# EAGLE design schematic (EAGLE 7.5.0)
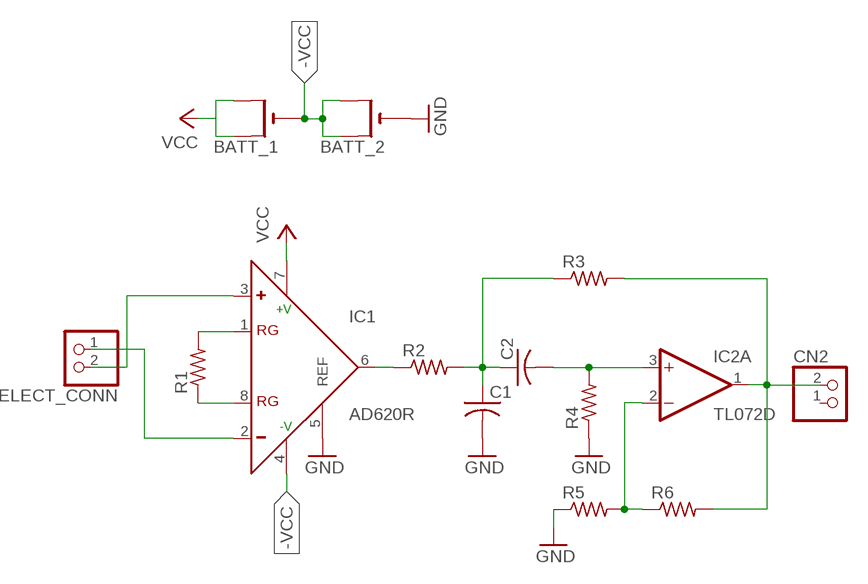
[diagram p0: schematic, sheet 1]

## Parts
BATT_1  CR1220SMT  [CR1220-SMD]
BATT_2  CR1220SMT  [CR1220-SMD]
C1  C-USC0805  [C0805]
C2  C-USC0805  [C0805]
CN2  JST_2PIN-SMT-RA  [JST-PH-2-SMT-RA]
ELECT_CONN  JST_2PIN-SMT-RA  [JST-PH-2-SMT-RA]
IC1  AD620R  [SO8]
IC2  TL072D  [SO08]
R1  R-US_R0805  [R0805]
R2  R-US_R0805  [R0805]
R3  R-US_R0805  [R0805]
R4  R-US_R0805  [R0805]
R5  R-US_R0805  [R0805]
R6  R-US_R0805  [R0805]

## Nets
-VCC: BATT_1.- BATT_2.+$1(+) BATT_2.+$2(+1) IC1.4(-V)
GND: BATT_2.- C1.2 IC1.5(REF) R4.1 R5.1
N$1: IC1.1(RG) R1.2
N$2: IC1.8(RG) R1.1
N$3: IC1.6(OUT) R2.1
N$4: C1.1 C2.1 R2.2 R3.1
N$5: C2.2 IC2.3(A:+IN) R4.2
N$6: CN2.2 IC2.1(A:OUT) R3.2 R6.2
N$7: IC2.2(A:-IN) R5.2 R6.1
N$8: ELECT_CONN.2 IC1.3(+)
N$9: ELECT_CONN.1 IC1.2(-)
VCC: BATT_1.+$1(+) BATT_1.+$2(+1) IC1.7(+V)
Unconnected: CN2.1 IC2.5(B:+IN) IC2.6(B:-IN) IC2.7(B:OUT)

## Power pins joined to a net without a drawn wire
V+: IC2.8(P:V+)
V-: IC2.4(P:V-)

## Library data of the parts
BATT_1 BATT_2 = adafruit:CR1220: CR1216/CR1220/CR1225 12mm 3V lithium coin cell Great for battery packup. Both SMT and THM holders. Note the THM package has the ground pads on both sides of the PCB so that the masks are the same - this reduces the cost
C1 C2 = adafruit:C-US: CAPACITOR, American symbol
CN2 ELECT_CONN = adafruit:JST_2PIN: JST 2-Pin Connectors of various flavors SMT-RA (S2B-PH-SM4) 4UConnector #17311 SMT (B2B-PH-SM4) THM-RA (S2B-PH) THM (B2B-PH)
IC1 = analog-devices:AD620: Low Cost, Low Power, Instrumentation Amplifier Source: http://www.analog.com/UploadedFiles/Data_Sheets/37793330023930AD620_e.pdf; MPN: AD620AR; OC_FARNELL: 1464424; OC_NEWARK: 05F7109
IC2 = linear:TL072: OP AMP
R1-R6 = resistor:R-US_: RESISTOR, American symbol

## Net classes
0 default: width 0.305 mm, drill 0.61 mm, clearance 0.254 mm

## Board
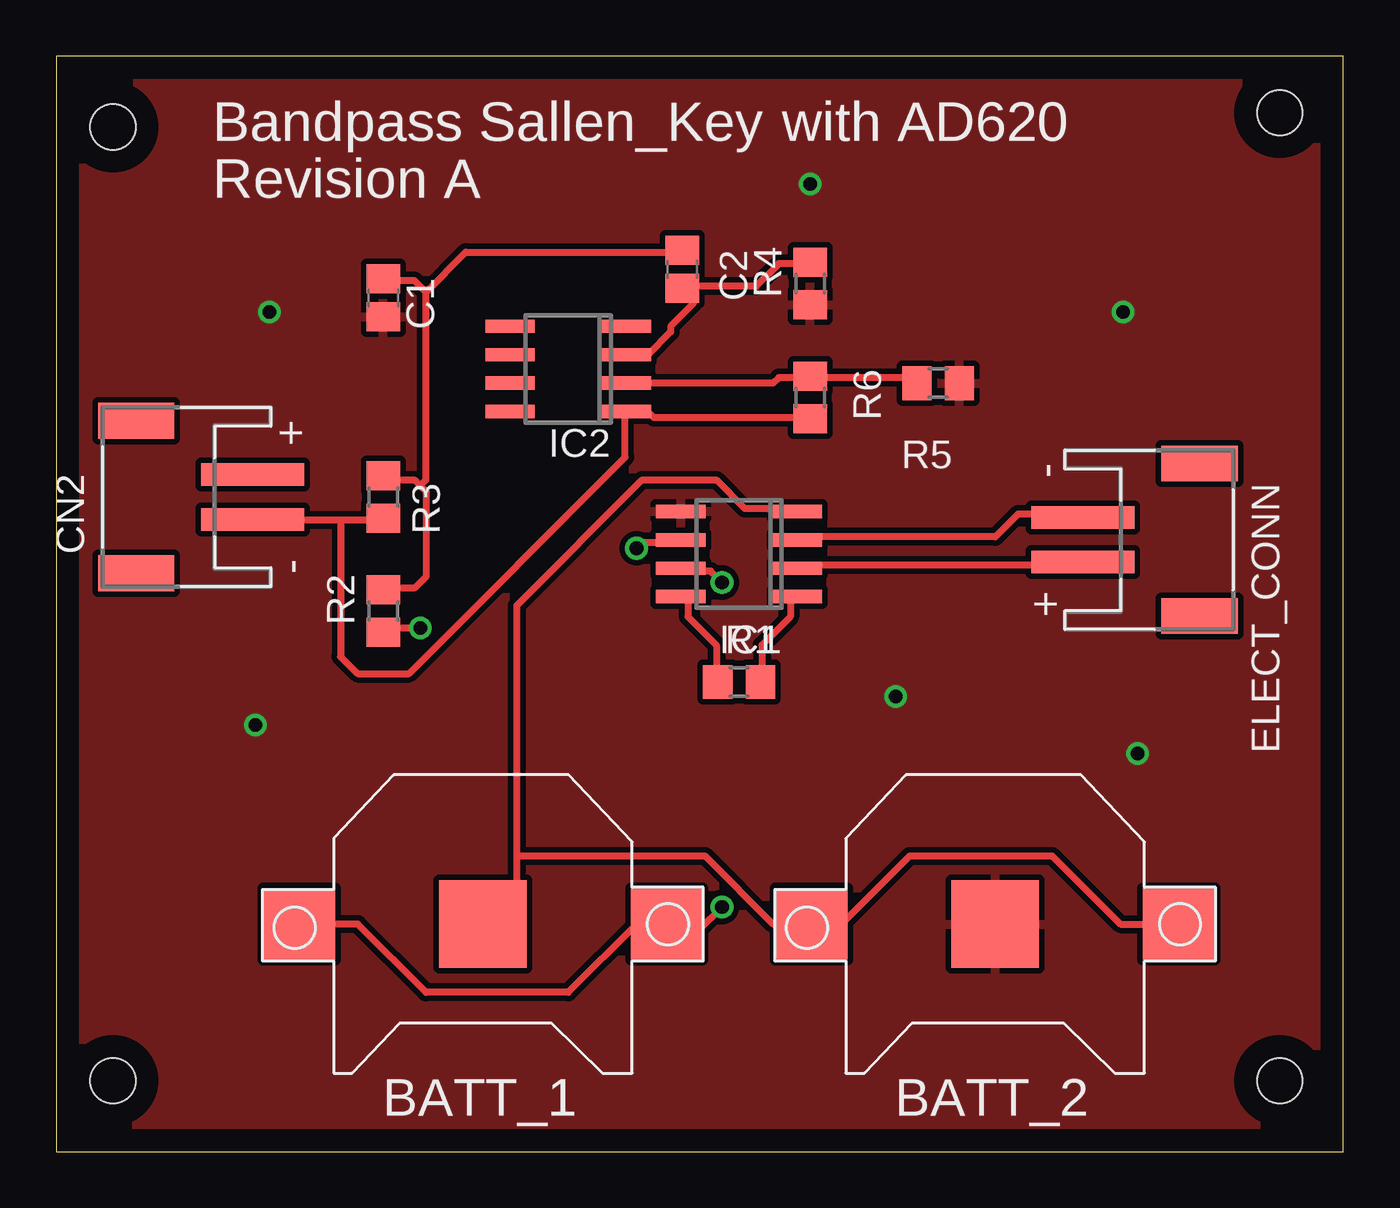
[diagram p1: board, top side]
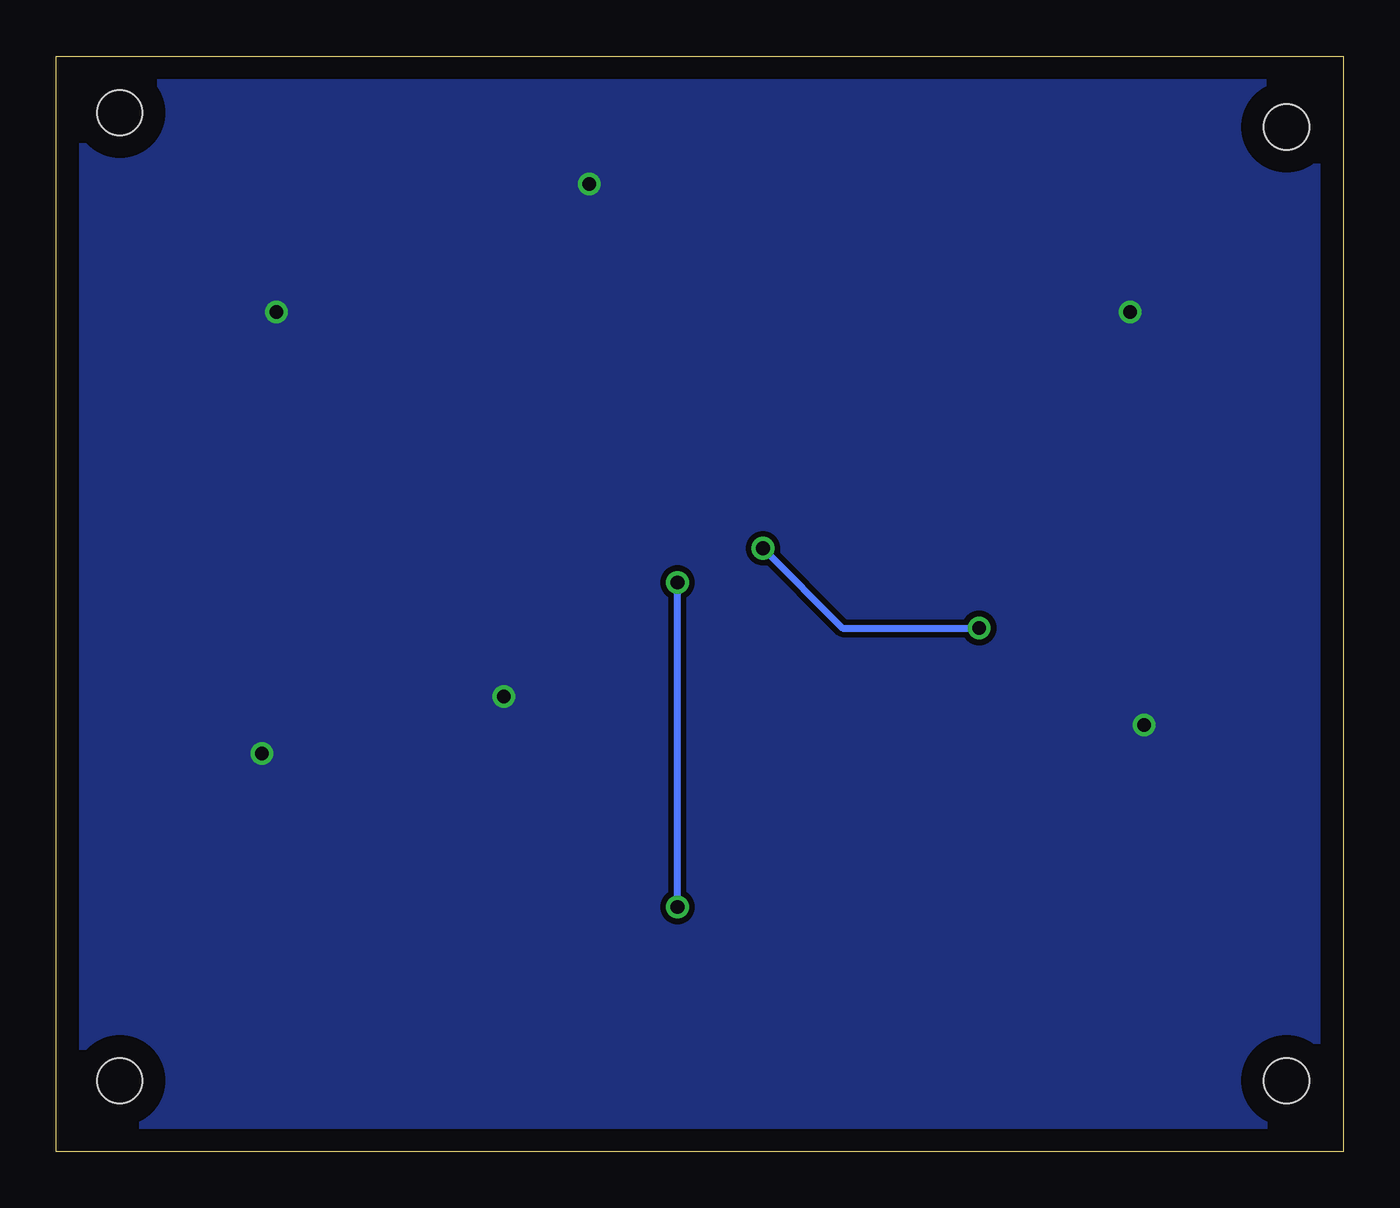
[diagram p2: board, bottom side, seen from below]

Size 57.45 x 48.88 mm. Coordinates in mm from the lower left corner, seen from the top.
Outline: 0,0 57.45,0 57.45,48.88 0,48.88 0,0
Copper layers (1*16): Top 0.035mm / dielectric 1.5mm / Bottom 0.035mm
Design rules "default *": minimum track width 10mil, minimum drill 20mil, track to track 8mil, track to pad 8mil, pad to pad 8mil, via to via 8mil, smd to smd 8mil, copper to edge 40mil, drill to drill 8mil, minimum pad ring 10mil, minimum via ring 8mil, stop-mask expansion 4mil, vias tented up to drill 0mil, thermal gap 10mil
Holes 2 mm at 2.54,45.72 2.54,3.17 54.61,3.17 54.61,46.35

### Footprints (pad centres in the part's own frame; a part is rotated, then mirrored left to right if it is on the bottom)
CR1220-SMD = smd 3.2 x 3.2: +$1 -8.2,0; +$2 8.2,0 | smd 3.9 x 3.9: - 0,0
C0805 = smd 1.3 x 1.5: 1 -0.85,0; 2 0.85,0
JST-PH-2-SMT-RA = smd 1 x 4.6: 1 1,-3.7; 2 -1,-3.7 | smd 1.6 x 3.4: NC1 -3.4,1.5; NC2 3.4,1.5
SO8 = smd 0.6 x 2.2: 1 -1.905,-2.6; 2 -0.635,-2.6; 3 0.635,-2.6; 4 1.905,-2.6; 5 1.905,2.6; 6 0.635,2.6; 7 -0.635,2.6; 8 -1.905,2.6
SO08 = smd 0.6 x 2.2: 1 -1.905,-2.6; 2 -0.635,-2.6; 3 0.635,-2.6; 4 1.905,-2.6; 5 1.905,2.6; 6 0.635,2.6; 7 -0.635,2.6; 8 -1.905,2.6
R0805 = smd 1.3 x 1.5: 1 -0.95,0; 2 0.95,0

### Placement (x,y rotation side)
BATT_1  19.05,10.16 180 top
BATT_2  41.91,10.16 180 top
C1  14.61,38.1 270 top
C2  27.94,39.37 270 top
CN2  5.08,29.21 90 top
ELECT_CONN  49.53,27.3 270 top
IC1  30.48,26.67 90 top
IC2  22.86,34.92 90 top
R1  30.48,20.95 0 top
R2  14.61,24.13 90 top
R3  14.61,29.21 270 top
R4  33.66,38.73 90 top
R5  39.37,34.29 180 top
R6  33.66,33.66 270 top

### Tracks (layer width: path | path; a pad name or v marks a point on that pad's centre or on a via)
-VCC
  Top 0.305: 20.57,13.21 20.57,11.68 BATT_1.- | 20.57,13.21 20.57,24.38 26.16,29.97 29.46,29.97 30.73,28.7 33.02,28.7 IC1.4 | 20.57,13.21 28.96,13.21 32,10.16 BATT_2.+$2 35.05,10.16 38.1,13.21 44.45,13.21 47.5,10.16 BATT_2.+$1
GND  (via drill 0.6)
  other vias: 9.53,37.47 8.89,19.05 47.62,37.47 37.47,20.32 48.26,17.78 33.66,43.18
  pour Top: -0.64,65.41 -0.64,-0.64 58.42,-0.64 58.42,65.41
  pour Bottom: -0.64,49.53 -0.64,-0.64 58.42,-0.64 58.42,49.53
N$1
  Top 0.305: R1.2 31.5,21.08 31.5,22.61 32.77,23.88 32.77,24.64 33.02,24.89 IC1.1
N$2
  Top 0.305: R1.1 29.46,21.08 29.46,22.61 28.19,23.88 28.19,24.64 27.94,24.89 IC1.8
N$3  (via drill 0.61)
  Top 0.305: v16.26,23.37 14.73,23.37 R2.1 | v25.91,26.92 26.16,27.18 27.69,27.18 IC1.6
  Bottom 0.305: v16.26,23.37 22.35,23.37 v25.91,26.92
N$4
  Top 0.305: 16.26,29.72 16,29.97 14.73,29.97 R3.1 | 16.26,29.72 16.51,29.46 16.51,25.65 16,25.15 14.73,25.15 R2.2 | 16.51,38.35 16,38.86 14.73,38.86 C1.1 | 16.51,38.35 16.51,29.97 16.26,29.72 | 16.51,38.35 18.29,40.13 27.94,40.13 C2.1
N$5
  Top 0.305: 28.45,38.61 31.24,38.61 32.26,39.62 33.53,39.62 R4.2 | 28.45,38.61 27.94,38.61 C2.2 28.45,38.61 | IC2.3 26.42,35.56 27.43,36.58 27.43,36.83 28.45,37.85 28.45,38.61
N$6
  Top 0.305: R6.2 33.53,32.77 26.67,32.77 26.42,33.02 IC2.1 25.4,33.02 25.4,30.99 15.75,21.34 13.46,21.34 12.7,22.1 12.7,28.19 | 12.7,28.19 8.89,28.19 CN2.2 | 12.7,28.19 14.48,28.19 R3.2
N$7
  Top 0.305: R5.2 38.35,34.29 38.1,34.54 33.78,34.54 R6.1 33.53,34.54 32.26,34.54 32,34.29 IC2.2
N$8
  Top 0.305: IC1.3 33.27,27.43 41.91,27.43 42.93,28.45 45.72,28.45 ELECT_CONN.2
N$9
  Top 0.305: IC1.2 33.27,26.16 45.72,26.16 ELECT_CONN.1
VCC  (via drill 0.61)
  Top 0.305: v29.72,25.4 29.21,25.91 27.94,25.91 IC1.7 | v29.72,10.92 28.7,9.91 27.69,9.91 27.43,10.16 BATT_1.+$1 25.91,10.16 22.86,7.11 16.51,7.11 13.46,10.16 BATT_1.+$2
  Bottom 0.305: v29.72,10.92 v29.72,25.4

### Text on the board
tPlace: Bandpass Sallen_Key | with AD620 | Revision A